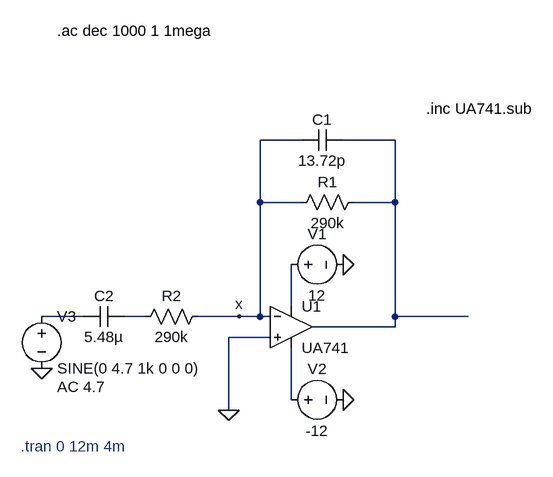
[diagram p0: schematic Filter Simulation.asc]
Filter Simulation.asc, the LTspice schematic file:
Version 4.1
SHEET 1 1028 680
WIRE 240 -64 176 -64
WIRE 384 -64 304 -64
WIRE 176 32 176 -64
WIRE 240 32 176 32
WIRE 384 32 384 -64
WIRE 384 32 320 32
WIRE 224 192 224 128
WIRE -96 208 -160 208
WIRE 0 208 -32 208
WIRE 144 208 80 208
WIRE 176 208 176 32
WIRE 176 208 144 208
WIRE 192 208 176 208
WIRE 384 208 384 32
WIRE 496 208 384 208
WIRE 384 224 384 208
WIRE 384 224 256 224
WIRE 192 240 128 240
WIRE 224 336 224 256
WIRE 128 352 128 240
FLAG 304 128 0
FLAG 304 336 0
FLAG 144 208 x
FLAG 128 352 0
FLAG -160 288 0
SYMBOL OpAmps\\opamp2 224 160 R0
SYMATTR InstName U1
SYMATTR Value UA741
SYMBOL voltage 208 128 R270
WINDOW 0 32 56 VTop 2
WINDOW 3 -32 56 VBottom 2
WINDOW 123 0 0 Left 0
WINDOW 39 0 0 Left 0
SYMATTR InstName V1
SYMATTR Value 12
SYMBOL voltage 208 336 R270
WINDOW 0 32 56 VTop 2
WINDOW 3 -32 56 VBottom 2
WINDOW 123 0 0 Left 0
WINDOW 39 0 0 Left 0
SYMATTR InstName V2
SYMATTR Value -12
SYMBOL res 336 16 R90
WINDOW 0 0 56 VBottom 2
WINDOW 3 32 56 VTop 2
SYMATTR InstName R1
SYMATTR Value 290k
SYMBOL cap 304 -80 R90
WINDOW 0 0 32 VBottom 2
WINDOW 3 32 32 VTop 2
SYMATTR InstName C1
SYMATTR Value 13.72p
SYMBOL res 96 192 R90
WINDOW 0 0 56 VBottom 2
WINDOW 3 32 56 VTop 2
SYMATTR InstName R2
SYMATTR Value 290k
SYMBOL cap -32 192 R90
WINDOW 0 0 32 VBottom 2
WINDOW 3 32 32 VTop 2
SYMATTR InstName C2
SYMATTR Value 5.48µ
SYMBOL voltage -160 192 R0
WINDOW 123 24 124 Left 2
WINDOW 39 0 0 Left 0
SYMATTR Value2 AC 4.7
SYMATTR InstName V3
SYMATTR Value SINE(0 4.7 1k 0 0 0)
TEXT -192 408 Left 2 ;.tran 0 12m 4m
TEXT 432 -112 Left 2 !.inc UA741.sub
TEXT -136 -232 Left 2 !.ac dec 1000 1 1mega

The netlist it stands for:
* Filter Simulation.asc
X§U1 0 x N002 N005 N001 UA741  ; pins In+ In- V+ V- OUT
V1 N002 0 12
V2 N005 0 -12
R1 N001 x 290k
C1 N001 x 13.72p
R2 x N004 290k
C2 N004 N003 5.48µ
V3 N003 0 SINE(0 4.7 1k 0 0 0) AC 4.7
* .tran 0 12m 4m
.inc UA741.sub
.ac dec 1000 1 1mega
.backanno
.end